# EAGLE schematic PS control unit V3 (EAGLE 7.4.0)
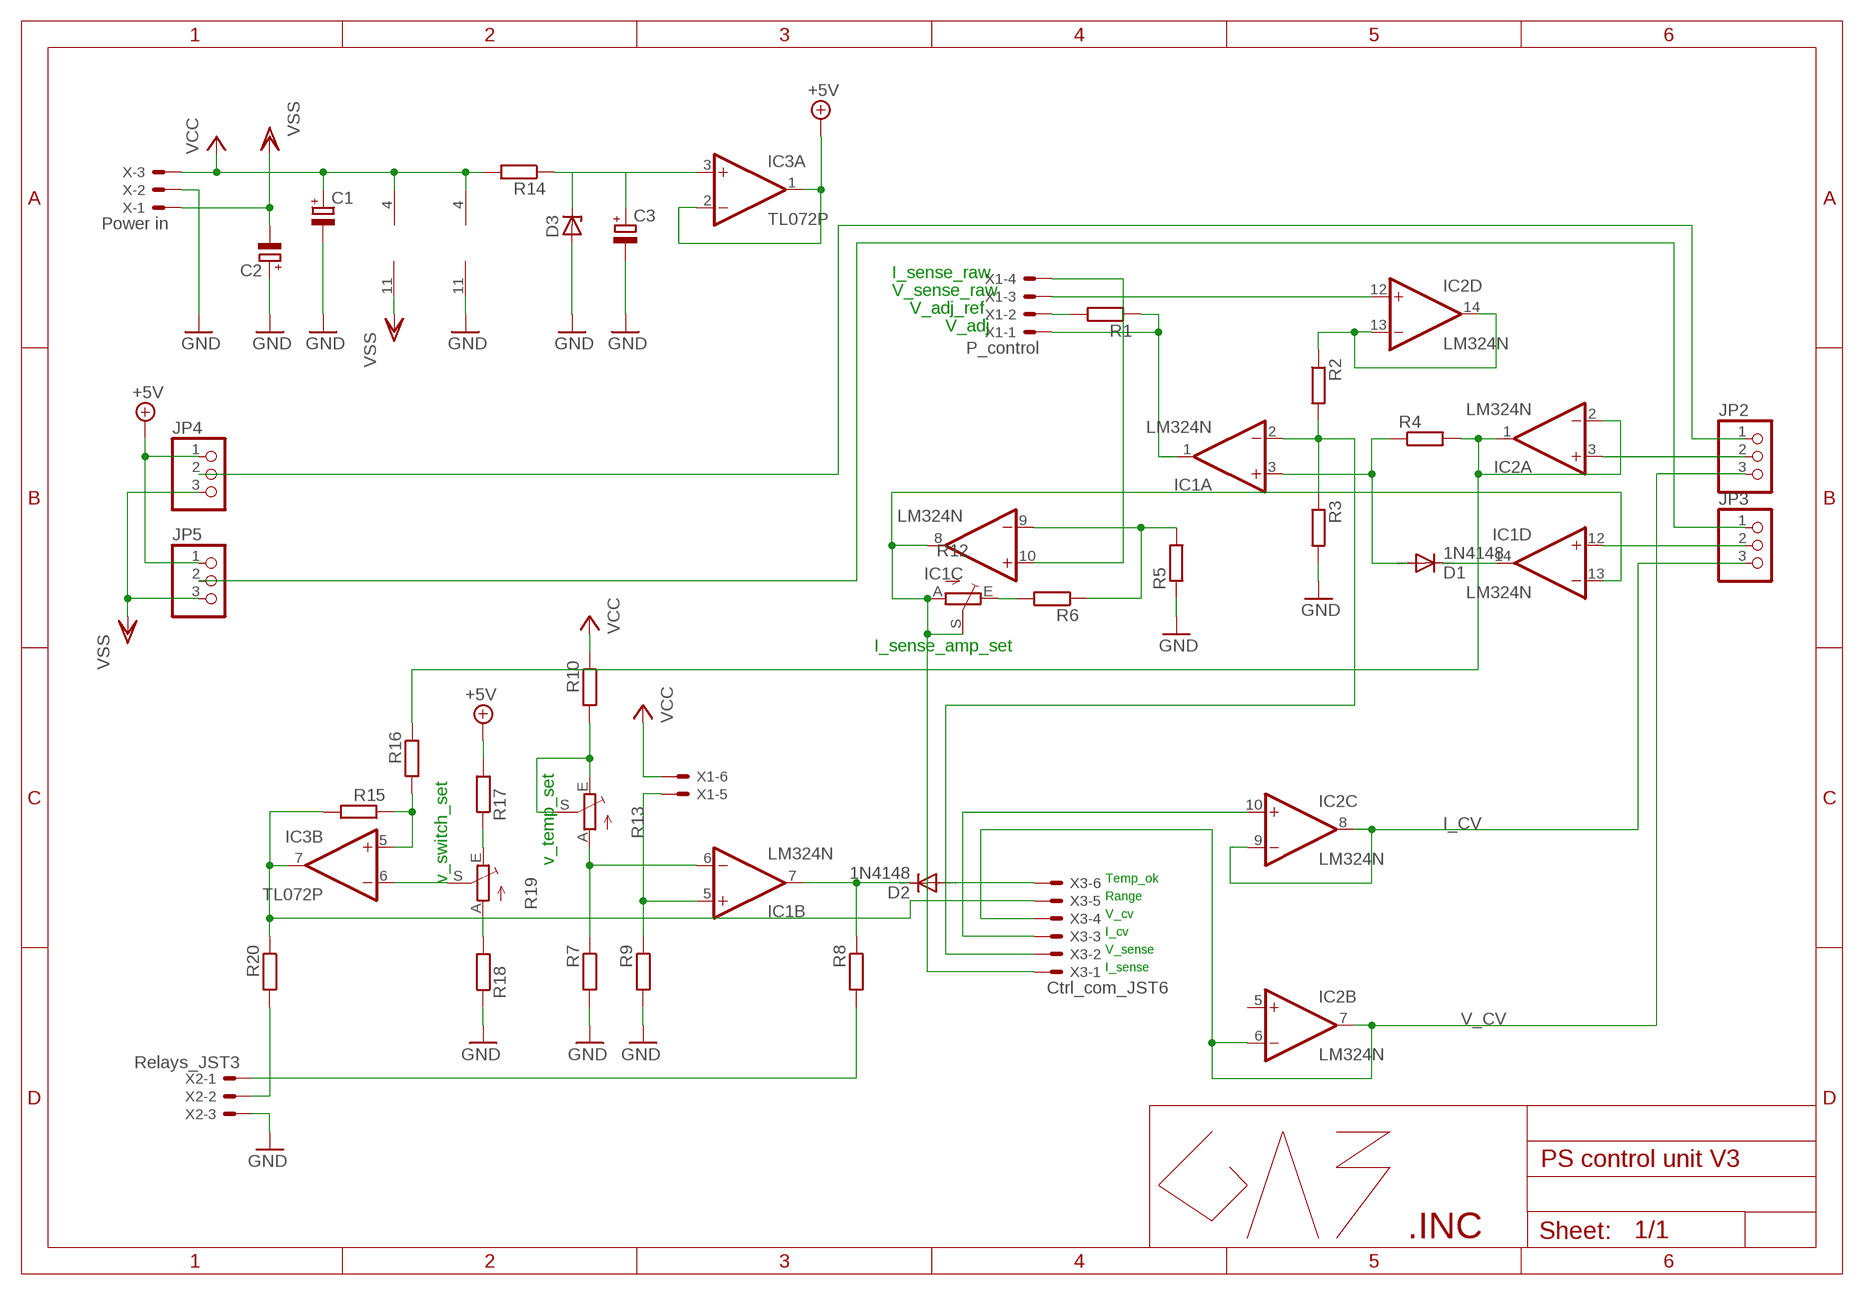
[diagram p0: schematic, sheet 1]

## Parts
C1  CPOL-EUE2.5-7  [E2,5-7]
C2  CPOL-EUE2-5  [E2-5]
C3  CPOL-EUE2-5  [E2-5]
D1  1N4148  1N4148DO35-10  [DO35-10]
D2  1N4148  1N4148DO35-10  [DO35-10]
D3  ZENER-DIODEDO35Z10  [DO35Z10]
IC1  LM324N  [DIL14]
IC2  LM324N  [DIL14]
IC3  TL072P  [DIL08]
JP2  PINHD-1X3  [1X03]
JP3  PINHD-1X3  [1X03]
JP4  PINHD-1X3  [1X03]
JP5  PINHD-1X3  [1X03]
R1  R-EU_0309/12  [0309/12]
R2  R-EU_0207/10  [0207/10]
R3  R-EU_0207/10  [0207/10]
R4  R-EU_0207/10  [0207/10]
R5  R-EU_0207/10  [0207/10]
R6  R-EU_0207/10  [0207/10]
R7  R-EU_0207/10  [0207/10]
R8  R-EU_0207/10  [0207/10]
R9  R-EU_0207/10  [0207/10]
R10  R-EU_0207/10  [0207/10]
R12  TRIM_EU-S64W  [S64W]
R13  TRIM_EU-S64W  [S64W]
R14  R-EU_0309/12  [0309/12]
R15  R-EU_0207/10  [0207/10]
R16  R-EU_0207/10  [0207/10]
R17  R-EU_0207/10  [0207/10]
R18  R-EU_0207/10  [0207/10]
R19  TRIM_EU-S64W  [S64W]
R20  R-EU_0207/10  [0207/10]
X  Power in  JST-XH-03-PIN-LONG-PAD  [JST-XH-03-PACKAGE-LONG-PAD]
X1  P_control  JST-XH-06-PIN-LONG-PAD  [JST-XH-06-PACKAGE-LONG-PAD]
X2  Relays_JST3  JST-XH-03-PIN-LONG-PAD  [JST-XH-03-PACKAGE-LONG-PAD]
X3  Ctrl_com_JST6  JST-XH-06-PIN-LONG-PAD  [JST-XH-06-PACKAGE-LONG-PAD]

## Nets
+5V: IC3.1(A:OUT) IC3.2(A:-IN) JP4.1 JP5.1 R17.2
GND: C1.- C2.+ C3.- D3.A IC2.11(P:V-) R3.2 R5.1 R7.2 R9.2 R18.1 X2.3 X.2
I_CV: IC2.8(C:OUT) IC2.9(C:-IN) JP3.3
N$1: D1.C IC1.14(D:OUT)
N$2: IC1.1(A:OUT) R1.1 X1.1
N$3: R1.2 X1.2
N$4: IC1.2(A:-IN) R2.2 R3.1 X3.2
N$5: IC2.12(D:+IN) X1.3
N$6: JP2.1 JP4.2
N$7: IC1.8(C:OUT) IC1.13(D:-IN) R12.A R12.S X3.1
N$8: IC2.13(D:-IN) IC2.14(D:OUT) R2.1
N$9: R6.2 R12.E
N$10: IC1.9(C:-IN) R5.2 R6.1
N$11: IC2.1(A:OUT) IC2.2(A:-IN) R4.2 R16.1
N$12: IC1.10(C:+IN) X1.4
N$13: IC1.5(B:+IN) R9.1 X1.5
N$14: D2.A X3.6
N$15: IC1.6(B:-IN) R7.1 R13.A
N$16: D2.C IC1.7(B:OUT) R8.1
N$17: R8.2 X2.1
N$18: IC2.3(A:+IN) JP2.2
N$19: IC1.12(D:+IN) JP3.2
N$20: C3.+ D3.C IC3.3(A:+IN) R14.1
N$21: R20.2 X2.2
N$22: IC3.5(B:+IN) R15.1 R16.2
N$23: IC3.7(B:OUT) R15.2 R20.1 X3.5
N$24: R17.1 R19.E
N$25: R18.2 R19.A
N$26: IC3.6(B:-IN) R19.S
N$27: JP3.1 JP5.2
N$28: D1.A IC1.3(A:+IN) R4.1
N$29: R10.2 R13.E R13.S
N$30: IC2.10(C:+IN) X3.3
V_CV: IC2.6(B:-IN) IC2.7(B:OUT) JP2.3 X3.4
VCC: C1.+ IC1.4(P:V+) IC2.4(P:V+) R10.1 R14.2 X1.6 X.3
VSS: C2.- IC1.11(P:V-) JP4.3 JP5.3 X.1
Unconnected: IC2.5(B:+IN)

## Notes on the sheet
- I_sense_raw
- V_sense_raw
- V_adj_ref
- V_adj
- I_sense_amp_set
- v_temp_set
- v_switch_set | Temp_ok
- Range
- V_cv
- I_cv
- V_sense
- I_sense
- .INC

## Power pins joined to a net without a drawn wire
V+: IC3.8(P:V+)
V-: IC3.4(P:V-)

## Library data of the parts
C1-C3 = rcl:CPOL-EU: POLARIZED CAPACITOR, European symbol
D1 D2 = diode:1N4148: DIODE high speed (Philips)
D3 = diode:ZENER-DIODE: Z-Diode
IC1 IC2 = linear:LM324: OP AMP
IC3 = linear:TL072: OP AMP
JP2-JP5 = pinhead:PINHD-1X3: PIN HEADER
R1-R10 R14-R18 R20 = resistor:R-EU_: RESISTOR, European symbol
R12 R13 R19 = pot:TRIM_EU-: POTENTIOMETER
X X2 = Rembrandt Electronics - JST XH Connectors v1-0:JST-XH-03-PIN: JST XH Connector 2 Pin Wire to board connector. Pitch: 2,54 mm, (0.100") Number of pins: 3 Created by Rembrandt Electronics www.rembrandtelectronics.com
X1 X3 = Rembrandt Electronics - JST XH Connectors v1-0:JST-XH-06-PIN: JST XH Connector 2 Pin Wire to board connector. Pitch: 2,54 mm, (0.100") Number of pins: 6 Created by Rembrandt Electronics www.rembrandtelectronics.com